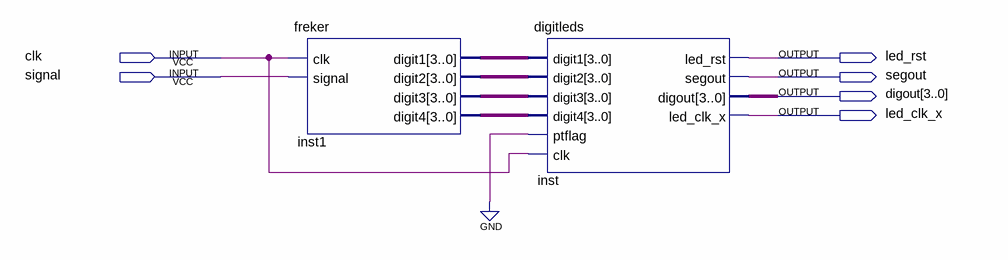
[diagram p0: schematic sheet]
// Quartus schematic freq.bdf as structural Verilog: 2 symbols, 6 pins
module freq (
  input  clk,
  input  signal,
  output led_rst,
  output segout,
  output [3:0] digout,
  output led_clk_x
);

  wire [3:0] inst1_digit1, inst1_digit2, inst1_digit3, inst1_digit4;

  freker inst1 (
    .clk(clk), .signal(signal), .digit1(inst1_digit1), .digit2(inst1_digit2), .digit3(inst1_digit3),
    .digit4(inst1_digit4));
  digitleds inst (
    .digit1(inst1_digit1), .digit2(inst1_digit2), .digit3(inst1_digit3), .digit4(inst1_digit4),
    .ptflag(1'b0), .clk(clk), .led_rst(led_rst), .segout(segout), .digout(digout), .led_clk_x(led_clk_x));
endmodule
